# EasyEDA schematic LED Canton Tower.json
TITLE: LED Canton Tower; REV: 1.0; Date: 2021-09-07; Sheet: 1/1; Drawn By: Charlee Li; Company: Your Company
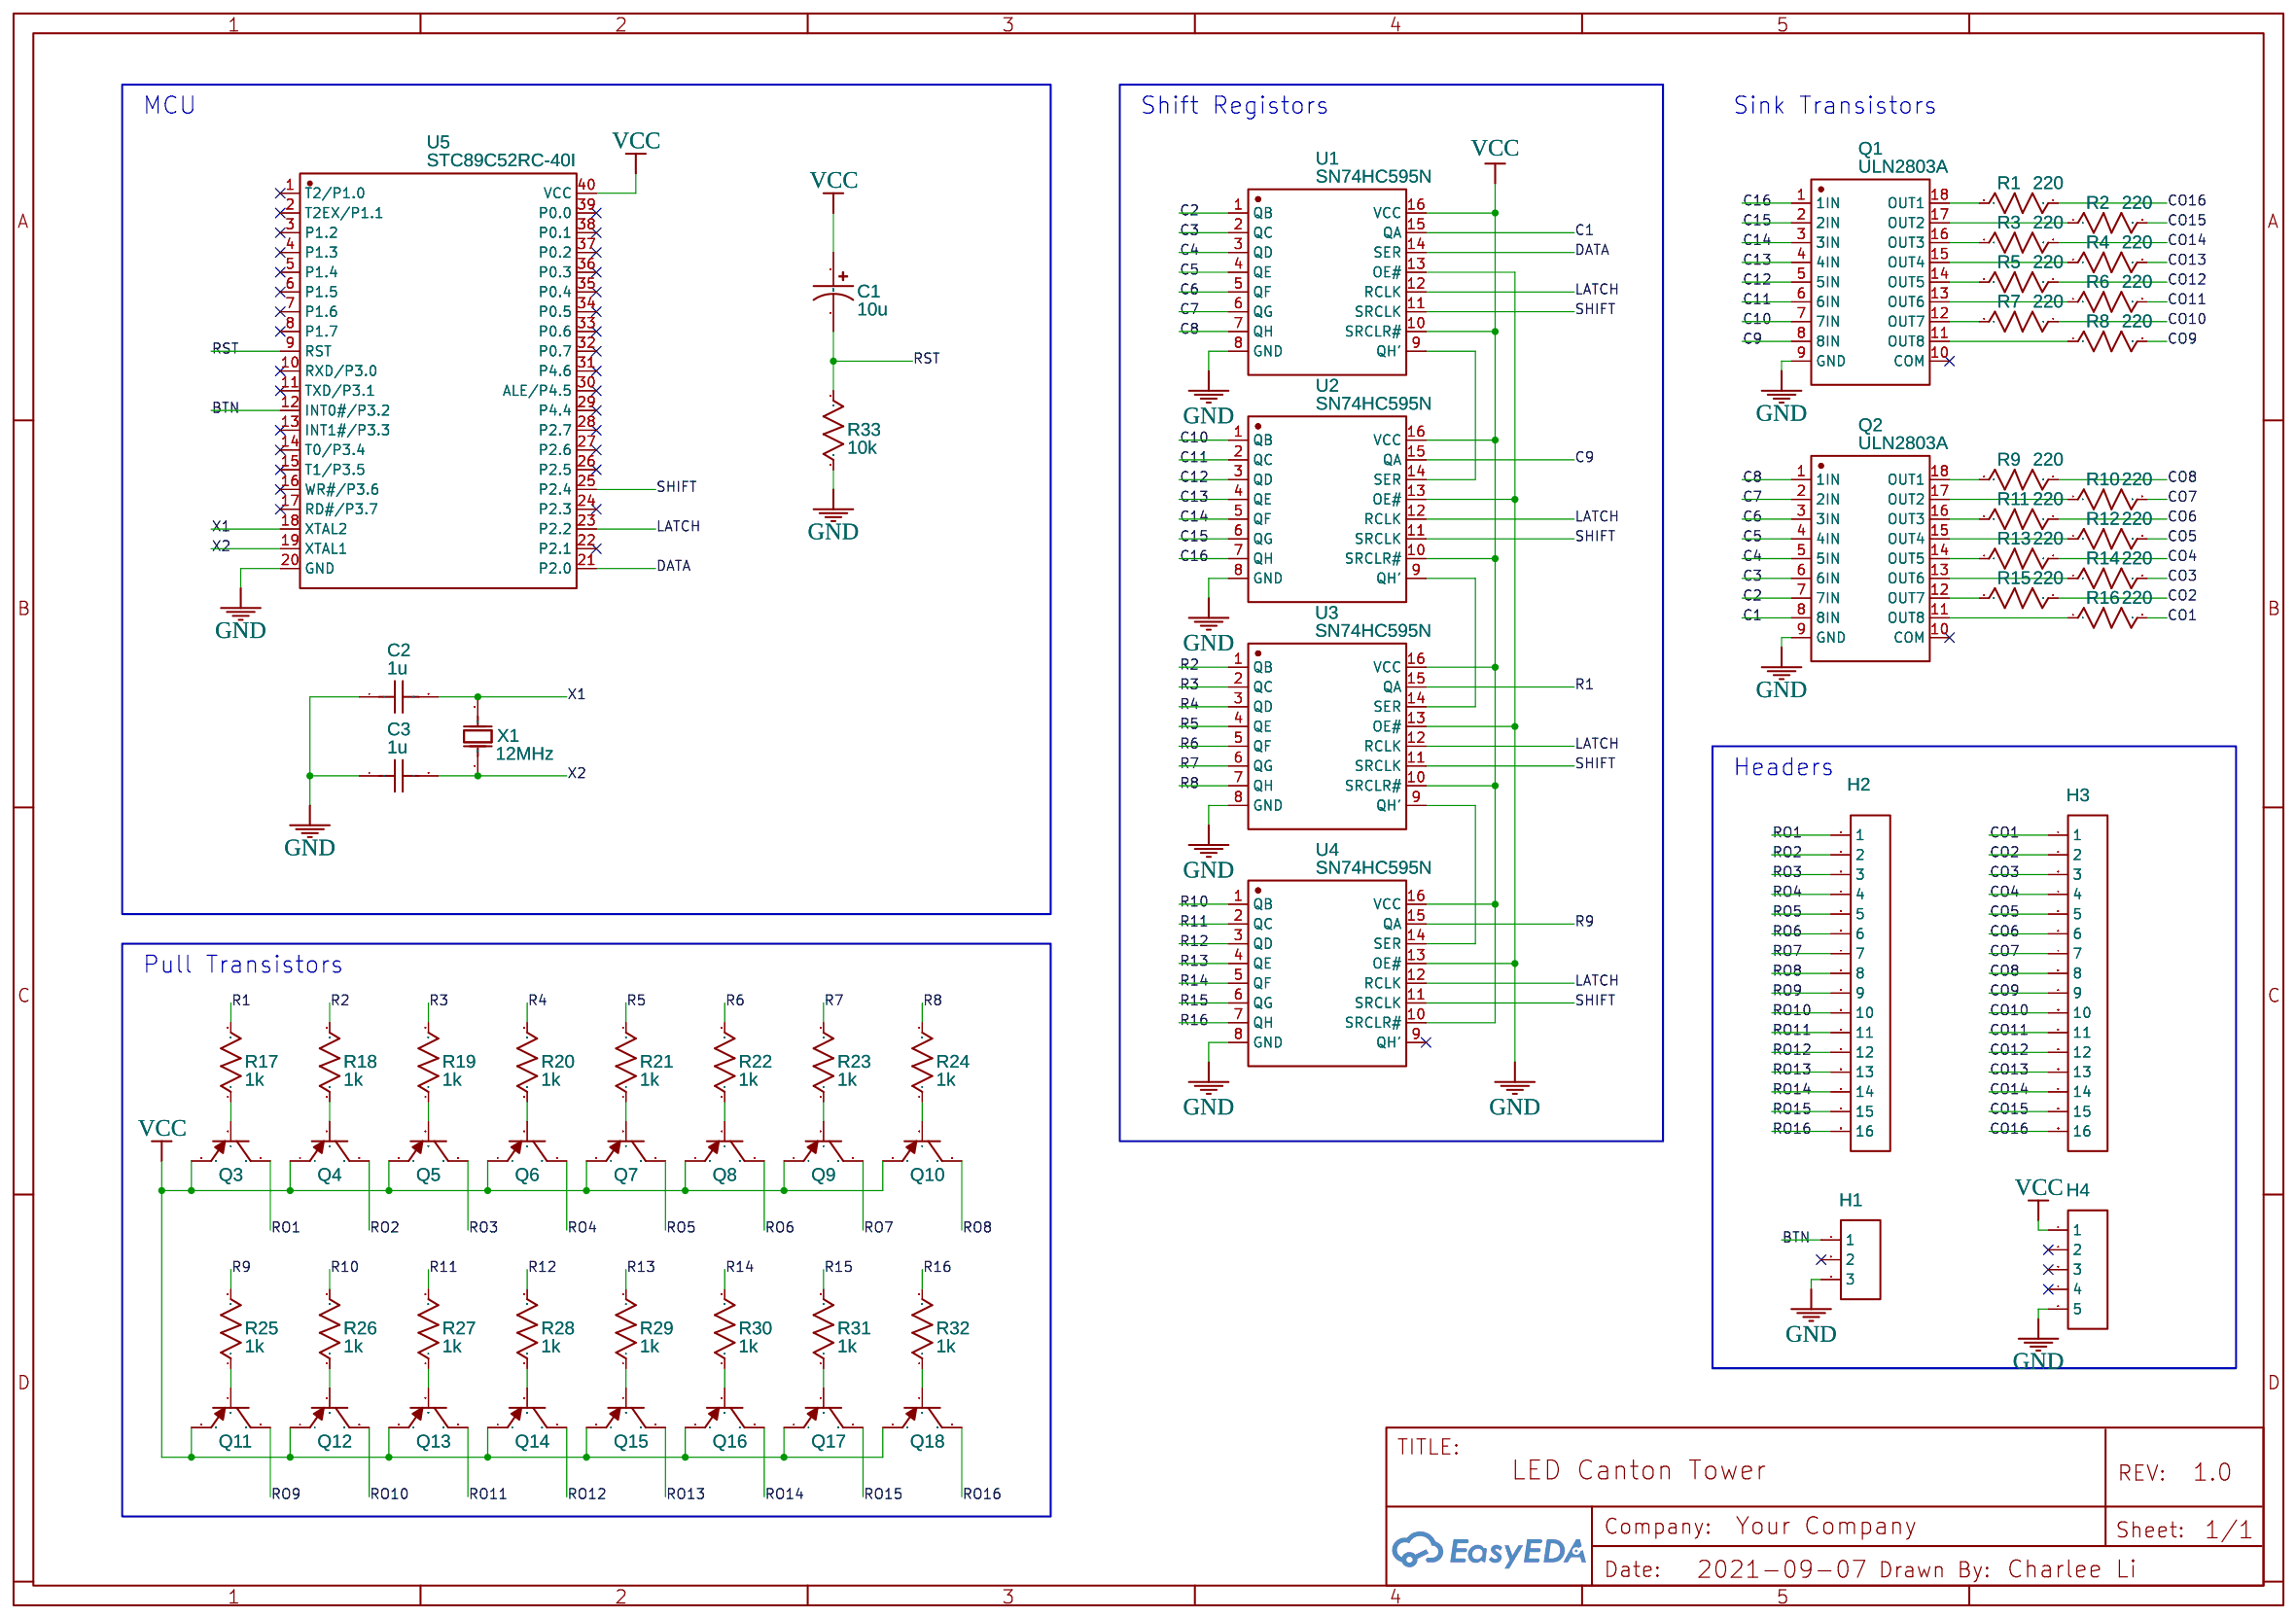
[diagram p0: schematic sheet]

## Parts
C1  10u  [CAP-D3.0×F1.5]
C2  1u  [RAD-0.1]
C3  1u  [RAD-0.1]
H1  HDR-F-2.54_1x3  [HDR-F-2.54_1X3]
H2  HDR-F-2.54_1x16  [HDR-F-2.54_1X16]
H3  HDR-F-2.54_1x16  [HDR-F-2.54_1X16]
H4  HDR-F-2.54_1x5  [HDR-F-2.54_1X5]
Q1  ULN2803A  [DIP-18_L23.0-W6.5-P2.54-LS7.6-BL]
Q2  ULN2803A  [DIP-18_L23.0-W6.5-P2.54-LS7.6-BL]
Q3  2N3906(TO-92)  [TO-92-3_L4.9-W3.7-P1.27-L]
Q4  2N3906(TO-92)  [TO-92-3_L4.9-W3.7-P1.27-L]
Q5  2N3906(TO-92)  [TO-92-3_L4.9-W3.7-P1.27-L]
Q6  2N3906(TO-92)  [TO-92-3_L4.9-W3.7-P1.27-L]
Q7  2N3906(TO-92)  [TO-92-3_L4.9-W3.7-P1.27-L]
Q8  2N3906(TO-92)  [TO-92-3_L4.9-W3.7-P1.27-L]
Q9  2N3906(TO-92)  [TO-92-3_L4.9-W3.7-P1.27-L]
Q10  2N3906(TO-92)  [TO-92-3_L4.9-W3.7-P1.27-L]
Q11  2N3906(TO-92)  [TO-92-3_L4.9-W3.7-P1.27-L]
Q12  2N3906(TO-92)  [TO-92-3_L4.9-W3.7-P1.27-L]
Q13  2N3906(TO-92)  [TO-92-3_L4.9-W3.7-P1.27-L]
Q14  2N3906(TO-92)  [TO-92-3_L4.9-W3.7-P1.27-L]
Q15  2N3906(TO-92)  [TO-92-3_L4.9-W3.7-P1.27-L]
Q16  2N3906(TO-92)  [TO-92-3_L4.9-W3.7-P1.27-L]
Q17  2N3906(TO-92)  [TO-92-3_L4.9-W3.7-P1.27-L]
Q18  2N3906(TO-92)  [TO-92-3_L4.9-W3.7-P1.27-L]
R1  220  [R_AXIAL-0.3]
R2  220  [R_AXIAL-0.3]
R3  220  [R_AXIAL-0.3]
R4  220  [R_AXIAL-0.3]
R5  220  [R_AXIAL-0.3]
R6  220  [R_AXIAL-0.3]
R7  220  [R_AXIAL-0.3]
R8  220  [R_AXIAL-0.3]
R9  220  [R_AXIAL-0.3]
R10  220  [R_AXIAL-0.3]
R11  220  [R_AXIAL-0.3]
R12  220  [R_AXIAL-0.3]
R13  220  [R_AXIAL-0.3]
R14  220  [R_AXIAL-0.3]
R15  220  [R_AXIAL-0.3]
R16  220  [R_AXIAL-0.3]
R17  1k  [R_AXIAL-0.3]
R18  1k  [R_AXIAL-0.3]
R19  1k  [R_AXIAL-0.3]
R20  1k  [R_AXIAL-0.3]
R21  1k  [R_AXIAL-0.3]
R22  1k  [R_AXIAL-0.3]
R23  1k  [R_AXIAL-0.3]
R24  1k  [R_AXIAL-0.3]
R25  1k  [R_AXIAL-0.3]
R26  1k  [R_AXIAL-0.3]
R27  1k  [R_AXIAL-0.3]
R28  1k  [R_AXIAL-0.3]
R29  1k  [R_AXIAL-0.3]
R30  1k  [R_AXIAL-0.3]
R31  1k  [R_AXIAL-0.3]
R32  1k  [R_AXIAL-0.3]
R33  10k  [R_AXIAL-0.3]
U1  SN74HC595N  [DIP-16_L19.8-W6.5-P2.54-LS7.6-BL]
U2  SN74HC595N  [DIP-16_L19.8-W6.5-P2.54-LS7.6-BL]
U3  SN74HC595N  [DIP-16_L19.8-W6.5-P2.54-LS7.6-BL]
U4  SN74HC595N  [DIP-16_L19.8-W6.5-P2.54-LS7.6-BL]
U5  STC89C52RC-40I  [DIP-40_L52.0-W13.7-P2.54-LS15.2-BL]
X1  12MHz  [OSC-TH_L11.1-W4.7-P4.88]

## Library data of the parts
C1 = CE_TH_D3.0×F1.5_US: Contributor: LCEDA_Lib
C2 C3 = C_RAD-0.1_US: Contributor: LCEDA_Lib
H1 = HDR-F-2.54_1x3: Supplier Part: C146690; Supplier: LCSC; Contributor: LCEDA_Lib
H2 H3 = HDR-F-2.54_1x16: Supplier Part: C66987; Supplier: LCSC; Contributor: LCEDA_Lib
H4 = HDR-F-2.54_1x5: Supplier Part: C50950; Supplier: LCSC; Contributor: LCEDA_Lib
Q1 Q2 = ULN2803A: Supplier: LCSC; Manufacturer: STMicroelectronics; Supplier Part: C73936; JLCPCB Part Class: Extended Part
Q3-Q18 = 2N3906(TO-92): Supplier: LCSC; Manufacturer: CJ; Manufacturer Part: 2N3906; Supplier Part: C9809; Contributor: LCEDA_Lib
R1-R33 = R_AXIAL-0.3_US: Contributor: LCEDA_Lib
U1-U4 = SN74HC595N: Supplier: LCSC; Manufacturer: TI; Supplier Part: C78711; JLCPCB Part Class: Extended Part
U5 = STC89C52RC-40I: Supplier: LCSC; Manufacturer: STC; Supplier Part: C14022; JLCPCB Part Class: Extended Part
X1 = X49UD12MSD2SC: Supplier: LCSC; Manufacturer: YXC; Supplier Part: C2188

## Nets
GND: C2.1 C3.1 H1.3 H4.5 Q1.9(GND) Q2.9(GND) R33.1 U1.8(GND) U1.13(OE#) U2.8(GND) U2.13(OE#) U3.8(GND) U3.13(OE#) U4.8(GND) U4.13(OE#) U5.20(GND)
VCC: C1.1 H4.1 Q3.1(E) Q4.1(E) Q5.1(E) Q6.1(E) Q7.1(E) Q8.1(E) Q9.1(E) Q10.1(E) Q11.1(E) Q12.1(E) Q13.1(E) Q14.1(E) Q15.1(E) Q16.1(E) Q17.1(E) Q18.1(E) U1.10(SRCLR#) U1.16(VCC) U2.10(SRCLR#) U2.16(VCC) U3.10(SRCLR#) U3.16(VCC) U4.10(SRCLR#) U4.16(VCC) U5.40(VCC)
BTN: H1.1 U5.12(INT0#/P3.2)
C1: Q2.8(8IN) U1.15(QA)
C2: Q2.7(7IN) U1.1(QB)
C3: Q2.6(6IN) U1.2(QC)
C4: Q2.5(5IN) U1.3(QD)
C5: Q2.4(4IN) U1.4(QE)
C6: Q2.3(3IN) U1.5(QF)
C7: Q2.2(2IN) U1.6(QG)
C8: Q2.1(1IN) U1.7(QH)
C9: Q1.8(8IN) U2.15(QA)
C10: Q1.7(7IN) U2.1(QB)
C11: Q1.6(6IN) U2.2(QC)
C12: Q1.5(5IN) U2.3(QD)
C13: Q1.4(4IN) U2.4(QE)
C14: Q1.3(3IN) U2.5(QF)
C15: Q1.2(2IN) U2.6(QG)
C16: Q1.1(1IN) U2.7(QH)
CO1: H3.1 R16.2
CO2: H3.2 R15.2
CO3: H3.3 R14.2
CO4: H3.4 R13.2
CO5: H3.5 R12.2
CO6: H3.6 R11.2
CO7: H3.7 R10.2
CO8: H3.8 R9.2
CO9: H3.9 R8.2
CO10: H3.10 R7.2
CO11: H3.11 R6.2
CO12: H3.12 R5.2
CO13: H3.13 R4.2
CO14: H3.14 R3.2
CO15: H3.15 R2.2
CO16: H3.16 R1.2
DATA: U1.14(SER) U5.21(P2.0)
LATCH: U1.12(RCLK) U2.12(RCLK) U3.12(RCLK) U4.12(RCLK) U5.23(P2.2)
R1: R17.2 U3.15(QA)
R2: R18.2 U3.1(QB)
R3: R19.2 U3.2(QC)
R4: R20.2 U3.3(QD)
R5: R21.2 U3.4(QE)
R6: R22.2 U3.5(QF)
R7: R23.2 U3.6(QG)
R8: R24.2 U3.7(QH)
R9: R25.2 U4.15(QA)
R10: R26.2 U4.1(QB)
R11: R27.2 U4.2(QC)
R12: R28.2 U4.3(QD)
R13: R29.2 U4.4(QE)
R14: R30.2 U4.5(QF)
R15: R31.2 U4.6(QG)
R16: R32.2 U4.7(QH)
RO1: H2.1 Q3.3(C)
RO2: H2.2 Q4.3(C)
RO3: H2.3 Q5.3(C)
RO4: H2.4 Q6.3(C)
RO5: H2.5 Q7.3(C)
RO6: H2.6 Q8.3(C)
RO7: H2.7 Q9.3(C)
RO8: H2.8 Q10.3(C)
RO9: H2.9 Q11.3(C)
RO10: H2.10 Q12.3(C)
RO11: H2.11 Q13.3(C)
RO12: H2.12 Q14.3(C)
RO13: H2.13 Q15.3(C)
RO14: H2.14 Q16.3(C)
RO15: H2.15 Q17.3(C)
RO16: H2.16 Q18.3(C)
RST: C1.2 R33.2 U5.9(RST)
SHIFT: U1.11(SRCLK) U2.11(SRCLK) U3.11(SRCLK) U4.11(SRCLK) U5.25(P2.4)
X1: C2.2 U5.18(XTAL2) X1.2(OSC2)
X2: C3.2 U5.19(XTAL1) X1.1(OSC1)
Net-(Q1-11): Q1.11(OUT8) R8.1
Net-(Q1-12): Q1.12(OUT7) R7.1
Net-(Q1-13): Q1.13(OUT6) R6.1
Net-(Q1-14): Q1.14(OUT5) R5.1
Net-(Q1-15): Q1.15(OUT4) R4.1
Net-(Q1-16): Q1.16(OUT3) R3.1
Net-(Q1-17): Q1.17(OUT2) R2.1
Net-(Q1-18): Q1.18(OUT1) R1.1
Net-(Q2-11): Q2.11(OUT8) R16.1
Net-(Q2-12): Q2.12(OUT7) R15.1
Net-(Q2-13): Q2.13(OUT6) R14.1
Net-(Q2-14): Q2.14(OUT5) R13.1
Net-(Q2-15): Q2.15(OUT4) R12.1
Net-(Q2-16): Q2.16(OUT3) R11.1
Net-(Q2-17): Q2.17(OUT2) R10.1
Net-(Q2-18): Q2.18(OUT1) R9.1
Net-(Q3-2): Q3.2(B) R17.1
Net-(Q4-2): Q4.2(B) R18.1
Net-(Q5-2): Q5.2(B) R19.1
Net-(Q6-2): Q6.2(B) R20.1
Net-(Q7-2): Q7.2(B) R21.1
Net-(Q8-2): Q8.2(B) R22.1
Net-(Q9-2): Q9.2(B) R23.1
Net-(Q10-2): Q10.2(B) R24.1
Net-(Q11-2): Q11.2(B) R25.1
Net-(Q12-2): Q12.2(B) R26.1
Net-(Q13-2): Q13.2(B) R27.1
Net-(Q14-2): Q14.2(B) R28.1
Net-(Q15-2): Q15.2(B) R29.1
Net-(Q16-2): Q16.2(B) R30.1
Net-(Q17-2): Q17.2(B) R31.1
Net-(Q18-2): Q18.2(B) R32.1
Net-(U1-9): U1.9(QH') U2.14(SER)
Net-(U2-9): U2.9(QH') U3.14(SER)
Net-(U3-9): U3.9(QH') U4.14(SER)

Not connected (* = marked no-connect by the designer): H1 2*; H4 2* 3* 4*; Q1 10(COM)*; Q2 10(COM)*; U4 9(QH')*; U5 1(T2/P1.0)* 2(T2EX/P1.1)* 3(P1.2)* 4(P1.3)* 5(P1.4)* 6(P1.5)* 7(P1.6)* 8(P1.7)* 10(RXD/P3.0)* 11(TXD/P3.1)* 13(INT1#/P3.3)* 14(T0/P3.4)* 15(T1/P3.5)* 16(WR#/P3.6)* 17(RD#/P3.7)* 22(P2.1)* 24(P2.3)* 26(P2.5)* 27(P2.6)* 28(P2.7)* 29(P4.4)* 30(ALE/P4.5)* 31(P4.6)* 32(P0.7)* 33(P0.6)* 34(P0.5)* 35(P0.4)* 36(P0.3)* 37(P0.2)* 38(P0.1)* 39(P0.0)*

## Notes on the sheet
- MCU
- Shift Registors
- Sink Transistors
- Headers
- Pull Transistors
